# Altium project Main_controller_FOC.PrjPcb
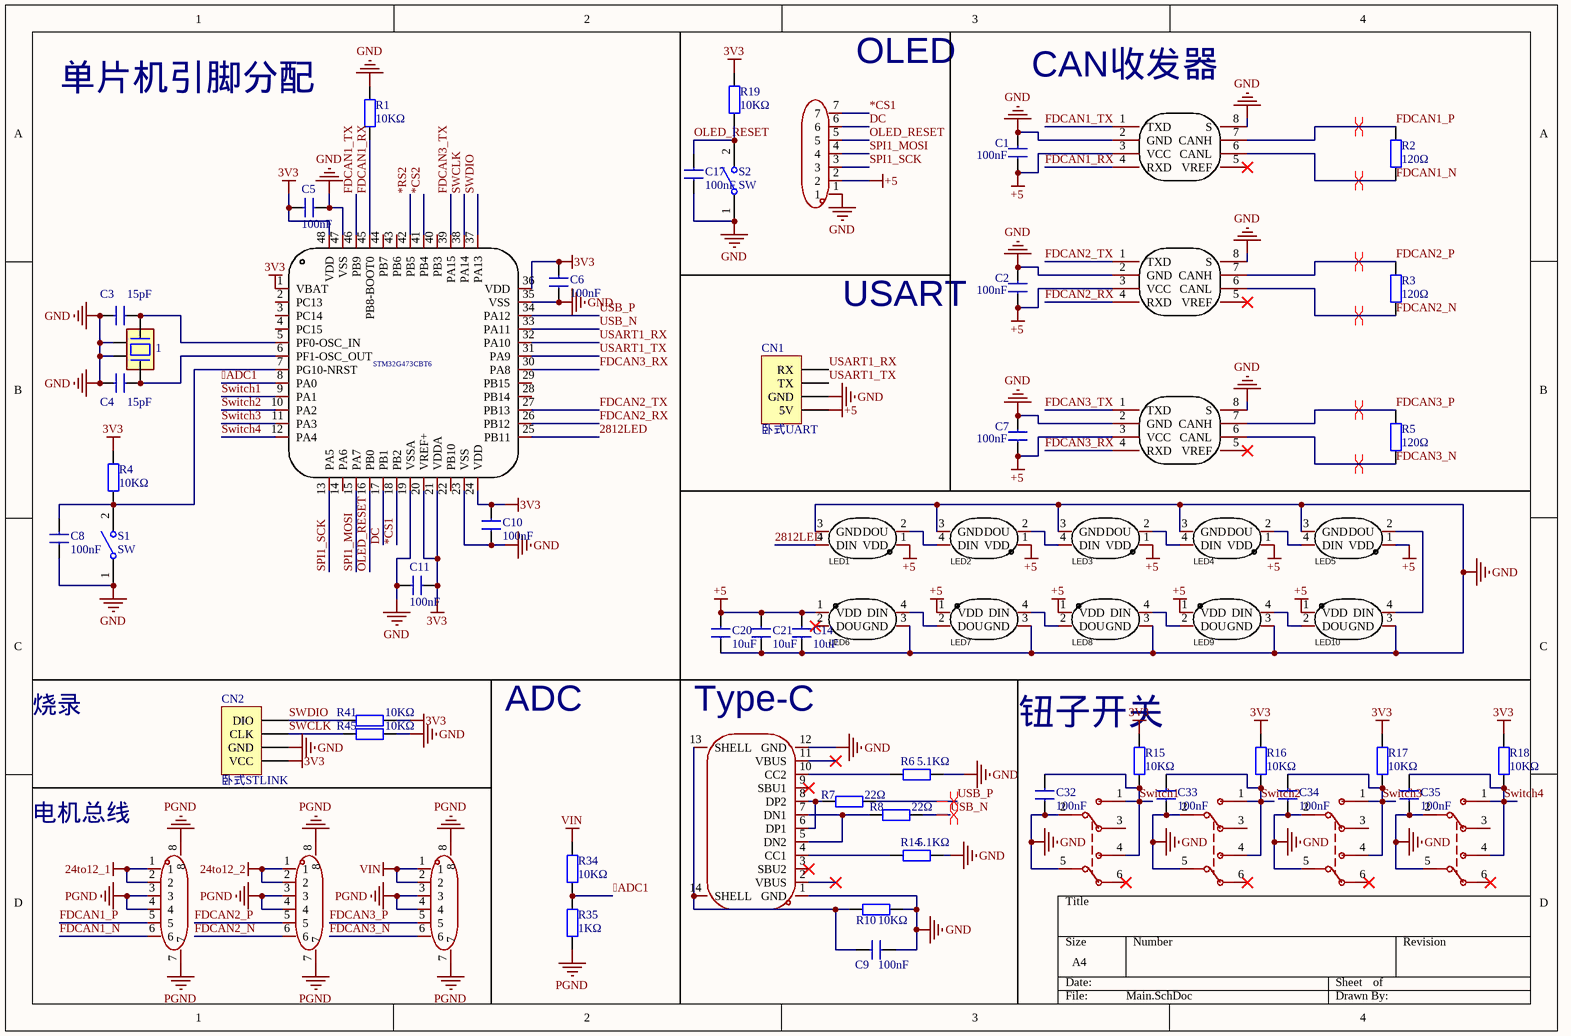
[diagram p0: Main.SchDoc]
2 sheets, 141 parts. Net scope: global (net labels, ports and power ports of the same name join across sheets).
Board file: PCB2.PcbDoc
Sheets:
  Main.SchDoc
  Power.SchDoc

## Sheet Main.SchDoc
size A4; SheetNumber: 1; SheetTotal: 2

### Parts
1  3225贴片晶振  [OSC-3225-4P]  (value not drawn)
C1  100nF  [c0402]
C2  100nF  [c0402]
C3  15pF  [c0402]
C4  15pF  [c0402]
C5  100nF  [c0402]
C6  100nF  [c0402]
C7  100nF  [c0402]
C8  100nF  [c0402]
C9  100nF  [c0402]
C10  100nF  [c0402]
C11  100nF  [c0402]
C14  10uF  [1210]
C17  100nF  [c0402]
C20  10uF  [1210]
C21  10uF  [1210]
C32  100nF  [c0402]
C33  100nF  [c0402]
C34  100nF  [c0402]
C35  100nF  [c0402]
CN1  卧式UART  [CONN-SMD_4P-P1.25_GH1.25-4P]
CN2  卧式STLINK  [CONN-SMD_4P-P1.25_GH1.25-4P]
H1  PM254V-11-07-H85  [HDR-TH_7P-P2.54-V-F]  (value not drawn)
LED1  XL-5050RGBC-WS2812B  [LED-SMD_4P-L5.0-W5.0-BL_XL-5050RGBC]  (value not drawn)
LED2  XL-5050RGBC-WS2812B  [LED-SMD_4P-L5.0-W5.0-BL_XL-5050RGBC]  (value not drawn)
LED3  XL-5050RGBC-WS2812B  [LED-SMD_4P-L5.0-W5.0-BL_XL-5050RGBC]  (value not drawn)
LED4  XL-5050RGBC-WS2812B  [LED-SMD_4P-L5.0-W5.0-BL_XL-5050RGBC]  (value not drawn)
LED5  XL-5050RGBC-WS2812B  [LED-SMD_4P-L5.0-W5.0-BL_XL-5050RGBC]  (value not drawn)
LED6  XL-5050RGBC-WS2812B  [LED-SMD_4P-L5.0-W5.0-BL_XL-5050RGBC]  (value not drawn)
LED7  XL-5050RGBC-WS2812B  [LED-SMD_4P-L5.0-W5.0-BL_XL-5050RGBC]  (value not drawn)
LED8  XL-5050RGBC-WS2812B  [LED-SMD_4P-L5.0-W5.0-BL_XL-5050RGBC]  (value not drawn)
LED9  XL-5050RGBC-WS2812B  [LED-SMD_4P-L5.0-W5.0-BL_XL-5050RGBC]  (value not drawn)
LED10  XL-5050RGBC-WS2812B  [LED-SMD_4P-L5.0-W5.0-BL_XL-5050RGBC]  (value not drawn)
R1  10KΩ  [R0402]
R2  120Ω  [R0402]
R3  120Ω  [R0402]
R4  10KΩ  [R0402]
R5  120Ω  [R0402]
R6  5.1KΩ  [R0402]
R7  22Ω  [R0402]
R8  22Ω  [R0402]
R10  10KΩ  [R0402]
R14  5.1KΩ  [R0402]
R15  10KΩ  [R0402]
R16  10KΩ  [R0402]
R17  10KΩ  [R0402]
R18  10KΩ  [R0402]
R19  10KΩ  [R0402]
R34  10KΩ  [R0402]
R35  1KΩ  [R0402]
R41  10KΩ  [R0402]
R45  10KΩ  [R0402]
S1  SW  [KEY_SMD]
S2  SW  [KEY_SMD]
U1  ZX-ZH1.5-6PWT  [CONN-SMD_6P-P1.50_ZX-ZH1.5-6PWT]  (value not drawn)
U2  SN65HVD1050DR  [SOIC-8_L4.9-W3.9-P1.27-LS6.0-BL]  (value not drawn)
U3  ZX-ZH1.5-6PWT  [CONN-SMD_6P-P1.50_ZX-ZH1.5-6PWT]  (value not drawn)
U4  STM32G474CET6  [LQFP-48]  (value not drawn)
U5  SN65HVD1050DR  [SOIC-8_L4.9-W3.9-P1.27-LS6.0-BL]  (value not drawn)
U6  ZX-ZH1.5-6PWT  [CONN-SMD_6P-P1.50_ZX-ZH1.5-6PWT]  (value not drawn)
U8  SN65HVD1050DR  [SOIC-8_L4.9-W3.9-P1.27-LS6.0-BL]  (value not drawn)
U9  7208P1YZQI  [SW-TH_6P-L12.7-W11.4-P4.70-LS4.8]  (value not drawn)
U10  7208P1YZQI  [SW-TH_6P-L12.7-W11.4-P4.70-LS4.8]  (value not drawn)
U11  7208P1YZQI  [SW-TH_6P-L12.7-W11.4-P4.70-LS4.8]  (value not drawn)
U12  7208P1YZQI  [SW-TH_6P-L12.7-W11.4-P4.70-LS4.8]  (value not drawn)
USB1  TYPE-C 16PIN 2MD(073)  [USB-C-SMD_TYPE-C-6PIN-2MD-073]  (value not drawn)

### Nets
3V3: C5.2 C6.2 C10.2 C11.1 CN2.1(VCC) R4.2 R15.2 R16.2 R17.2 R18.2 R19.2 R41.2 U4.1(VBAT) U4.20(VREF+) U4.21(VDDA) U4.24(VDD) U4.36(VDD) U4.48(VDD)
24to12_1: U1.1 U1.2
24to12_2: U3.1 U3.2
+5: C1.1 C2.1 C7.1 C14.2 C20.2 C21.2 CN1.1(5V) H1.2 LED1.1(VDD) LED2.1(VDD) LED3.1(VDD) LED4.1(VDD) LED5.1(VDD) LED6.1(VDD) LED7.1(VDD) LED8.1(VDD) LED9.1(VDD) LED10.1(VDD) U2.3(VCC) U5.3(VCC) U8.3(VCC)
GND: 1.2 1.4 C1.2 C2.2 C3.1 C4.1 C5.1 C6.1 C7.2 C8.1 C9.2 C10.1 C11.2 C14.1 C17.1 C20.1 C21.1 C32.1 C33.1 C34.1 C35.1 CN1.2(GND) CN2.2(GND) H1.1 LED1.3(GND) LED2.3(GND) LED3.3(GND) LED4.3(GND) LED5.3(GND) LED6.3(GND) LED7.3(GND) LED8.3(GND) LED9.3(GND) LED10.3(GND) R1.1 R6.2 R10.2 R14.2 R45.2 S1.1(COMMON) S2.1(COMMON) U2.2(GND) U2.8(S) U4.19(VSSA) U4.23(VSS) U4.35(VSS) U4.47(VSS) U5.2(GND) U5.8(S) U8.2(GND) U8.8(S) U9.2 U9.5 U10.2 U10.5 U11.2 U11.5 U12.2 U12.5 USB1.1(GND) USB1.12(GND)
PGND: R35.1 U1.3 U1.4 U1.7 U1.8 U3.3 U3.4 U3.7 U3.8 U6.3 U6.4 U6.7 U6.8  [project net A2_1]
VIN: R34.2 U6.1 U6.2
2812LED: LED1.4(DIN) U4.25(PB11)
ADC1: R34.1 R35.2 U4.8(PA0)
*CS1: H1.7 U4.18(PB2)
*CS2: U4.41(PB4)
*RS2: U4.42(PB5)
DC: H1.6 U4.17(PB1)
FDCAN1_N: R2.1 U1.6 U2.6(CANL)
FDCAN1_P: R2.2 U1.5 U2.7(CANH)
FDCAN1_RX: R1.2 U2.4(RXD) U4.45(PB8-BOOT0)
FDCAN1_TX: U2.1(TXD) U4.46(PB9)
FDCAN2_N: R3.1 U3.6 U5.6(CANL)
FDCAN2_P: R3.2 U3.5 U5.7(CANH)
FDCAN2_RX: U4.26(PB12) U5.4(RXD)
FDCAN2_TX: U4.27(PB13) U5.1(TXD)
FDCAN3_N: R5.1 U6.6 U8.6(CANL)
FDCAN3_P: R5.2 U6.5 U8.7(CANH)
FDCAN3_RX: U4.30(PA8) U8.4(RXD)
FDCAN3_TX: U4.39(PA15) U8.1(TXD)
OLED_RESET: C17.2 H1.5 R19.1 S2.2(NO) U4.16(PB0)
SPI1_MOSI: H1.4 U4.15(PA7)
SPI1_SCK: H1.3 U4.13(PA5)
SWCLK: CN2.3(CLK) R45.1 U4.38(PA14)
SWDIO: CN2.4(DIO) R41.1 U4.37(PA13)
Switch1: C32.2 R15.1 U4.9(PA1) U9.1 U9.4
Switch2: C33.2 R16.1 U4.10(PA2) U10.1 U10.4
Switch3: C34.2 R17.1 U4.11(PA3) U11.1 U11.4
Switch4: C35.2 R18.1 U4.12(PA4) U12.1 U12.4
USART1_RX: CN1.4(RX) U4.32(PA10)
USART1_TX: CN1.3(TX) U4.31(PA9)
USB_N: R8.2 U4.33(PA11)
USB_P: R7.2 U4.34(PA12)
Net1_1: 1.1 C4.2 U4.6(PF1-OSC_OUT)
Net1_3: 1.3 C3.2 U4.5(PF0-OSC_IN)
NetC8_2: C8.2 R4.1 S1.2(NO) U4.7(PG10-NRST)
NetC9_1: C9.1 R10.1 USB1.13(SHELL) USB1.14(SHELL)
NetLED1_2: LED1.2(DOU) LED2.4(DIN)
NetLED2_2: LED2.2(DOU) LED3.4(DIN)
NetLED3_2: LED3.2(DOU) LED4.4(DIN)
NetLED4_2: LED4.2(DOU) LED5.4(DIN)
NetLED5_2: LED5.2(DOU) LED10.4(DIN)
NetLED6_4: LED6.4(DIN) LED7.2(DOU)
NetLED7_4: LED7.4(DIN) LED8.2(DOU)
NetLED8_4: LED8.4(DIN) LED9.2(DOU)
NetLED9_4: LED9.4(DIN) LED10.2(DOU)
NetR6_1: R6.1 USB1.10(CC2)
NetR7_1: R7.1 USB1.6(DP1) USB1.8(DP2)
NetR8_1: R8.1 USB1.5(DN2) USB1.7(DN1)
NetR14_1: R14.1 USB1.4(CC1)

Not connected (* = marked no-connect by the designer): LED6 2(DOU)*; U2 5(VREF)*; U4 2(PC13) 3(PC14) 4(PC15) 14(PA6) 22(PB10) 28(PB14) 29(PB15) 40(PB3) 43(PB6) 44(PB7); U5 5(VREF)*; U8 5(VREF)*; U9 3 6*; U10 3 6*; U11 3 6*; U12 3 6*; USB1 2(VBUS)* 3(SBU2)* 9(SBU1)* 11(VBUS)*

### Layout directives
differential pair: FDCAN1_N, FDCAN1_P, FDCAN2_N, FDCAN2_P, FDCAN3_N, FDCAN3_P, USB_N, USB_P

### Notes on the sheet
- 单片机引脚分配
- (near H1) OLED
- CAN收发器
- USART
- 烧录
- ADC
- Type-C
- 钮子开关
- 电机总线

### Library data of the parts
1 = 3225贴片晶振: Value: 16M
C1-C11 C17 C32-C35 = 0402贴片电容: 贴片电容0402
C14 C20 C21 = 1210贴片电容
H1 = PM254V-11-07-H85: Manufacturer: XFCN(兴飞); Add into BOM: yes; Holes Structure: 1x7P; Pitch: 2.54mm; Circular Hole / Square Hole: 方孔; Number of Holes: 7P; Current Rating (Max): 3A; Voltage Rating (Max): 250V; Holes Direction: 顶部; Symbol: PM254V-11-07-H85; Device: PM254V-11-07-H85; LCSC Part Name: 间距:2.54mm 1x7P 直插; Supplier Part: C2832270; Manufacturer Part: PM254V-11-07-H85; Supplier Footprint: 插件,P=2.54mm; JLCPCB Part Class: Extended Part; Datasheet: https://atta.szlcsc.com/upload/public/pdf/source/20210514/C2832270_F424CC0071A81298BFB56B53406F9842.pdf; Supplier: LCSC; Convert to PCB: yes; Row Spacing: -; Mounting Type: 直插; Number of Rows: 单排; Insulation Height: -; Operating Temperature Range: -40℃~+105℃
LED1-LED10 = WS2812B彩灯珠: Manufacturer: XINGLIGHT(成兴光); Add into BOM: yes; Emitted Color: RGB三色; Peak Wavelength: 625nm；470nm；530nm; Lens Color: 无色透明透镜; Viewing Angle: 120°; Mounting Sytle: 正贴; Symbol: XL-5050RGBC-WS2812B; Device: XL-5050RGBC-WS2812B; LCSC Part Name: XL-5050RGBC-WS2812B; Supplier Part: C2843785; Manufacturer Part: XL-5050RGBC-WS2812B; Supplier Footprint: SMD5050; JLCPCB Part Class: Extended Part; Datasheet: https://atta.szlcsc.com/upload/public/pdf/source/20230111/86AAD2096485A2E5BCAB883FF8CBE6FD.pdf; Supplier: LCSC; Convert to PCB: yes; Power Dissipation: -; Forward Current: -; Dominant Wavelength: -; Diode Configuration: -; Color Temperature: -; Operating Temperature: -20℃~+85℃
R1-R8 R10 R14-R19 R34 R35 R41 R45 = 0402贴片电阻: W: *
S1 S2 = SW: 开关
U1 U3 U6 = ZX-ZH1.5-6PWT: Manufacturer: Megastar(兆星); Add into BOM: yes; Pins Structure: 1x6P; Pitch: 1.5mm; Reference Series: ZH; Number of PINs Per Row: 6; Rated Current: 1A; Rated Voltage (Max): 250V; Plastic Material: LCP; Supplementary Features: 辅助焊脚; Z-Height of the Board: 3.8mm; X-Length of Bottom Edge on Board (Spacing Line): 12mm; Y-Width of Bottom Edge on Board: 6.5mm; Symbol: ZX-ZH1.5-6PWT; Device: ZX-ZH1.5-6PWT; LCSC Part Name: 1x6P 间距:1.5mm 卧贴 系列:ZH; Supplier Part: C19272409; Manufacturer Part: ZX-ZH1.5-6PWT; Supplier Footprint: SMD,P=1.5mm,卧贴; JLCPCB Part Class: Extended Part; Datasheet: https://atta.szlcsc.com/upload/public/pdf/source/20231201/C5A824B953C40A6060EBF5A541254C86.pdf; Supplier: LCSC; Convert to PCB: yes; Mounting Type: 卧贴; Number of Pins: 6P; Number of Rows: 1; Row Spacing: -; Contact Material: 黄铜; Contact Plating: 锡; Operating Temperature: -25℃~+85℃; Flame Retardant Rating: -; Color: 米色
U2 U5 U8 = SN65HVD1050DR: CAN芯片; Manufacturer: TI(德州仪器); Add into BOM: yes; Supply Voltage: 4.5V~5.5V; Supply Current: 50mA; Name: SN65HVD1050DR; Symbol: SN65HVD1050DR; Device: SN65HVD1050DR; LCSC Part Name: 4.5V~5.5V; Supplier Part: C14019; Manufacturer Part: SN65HVD1050DR; Supplier Footprint: SOIC-8; JLCPCB Part Class: Extended Part; Datasheet: https://www.ti.com/cn/lit/gpn/sn65hvd1050; Supplier: LCSC; Convert to PCB: yes; Type: 收发器; Operating Temperature: -40℃~+125℃
U4 = STM32G474CET6: Manufacturer: ST(意法半导体); Symbol: STM32G473CBT6; Add into BOM: yes; Device: STM32G473CBT6; Supplier: LCSC; Supplier Part: C730111; Manufacturer Part: STM32G473CBT6; JLCPCB Part Class: Extended Part; LCSC Part Name: STM32G473CBT6; Supplier Footprint: LQFP-48(7x7); Datasheet: https://atta.szlcsc.com/upload/public/pdf/source/20200902/C730111_19331807E2800E1C1C13BFFAAC550E20.pdf; Convert to PCB: yes
U9-U12 = 7208P1YZQI: Manufacturer: C&K; Add into BOM: yes; Circuit: 双刀双掷; Voltage Rating (AC): 120V; Voltage Rating (DC): 28V; Actuator Type: 圆柱钮柄; Pin Style: 焊片; Symbol: 7208P1YZQI; Device: 7208P1YZQI; LCSC Part Name: 7208P1YZQI 五件套; Supplier Part: C2824481; Manufacturer Part: 7208P1YZQI; Supplier Footprint: 插件; JLCPCB Part Class: Extended Part; Datasheet: https://atta.szlcsc.com/upload/public/pdf/source/20211221/AC201C7675510E1A13CA92FD8B8259B6.pdf; Supplier: LCSC; Convert to PCB: yes; Mounting Style: 直插; Operating Temperature: -30℃~+85℃
USB1 = TYPE-C 16PIN 2MD(073): Manufacturer: SHOU HAN(首韩); Add into BOM: yes; Gender: 母; Number of Contacts: 16P; Number of Ports: 1; Current Rating - Power (Max): 5A; Rated Voltage (Max): 5V; Connect-Disconnect Life: 5千次; Core Colour: 黑色; Symbol: TYPE-C 16PIN 2MD(073); Device: TYPE-C 16PIN 2MD(073); LCSC Part Name: Type-C 母 卧贴; Supplier Part: C2765186; Manufacturer Part: TYPE-C 16PIN 2MD(073); Supplier Footprint: SMD; JLCPCB Part Class: Extended Part; Datasheet: https://atta.szlcsc.com/upload/public/pdf/source/20211123/39B17C16241EAC15C5E277BDA434118E.pdf; Supplier: LCSC; Convert to PCB: yes; Connector Type: Type-C; Standard: USB 3.1; Mounting Style: 卧贴; Operating Temperature Range: -25℃~+85℃

## Sheet Power.SchDoc
size A3; SheetNumber: 2; SheetTotal: 2
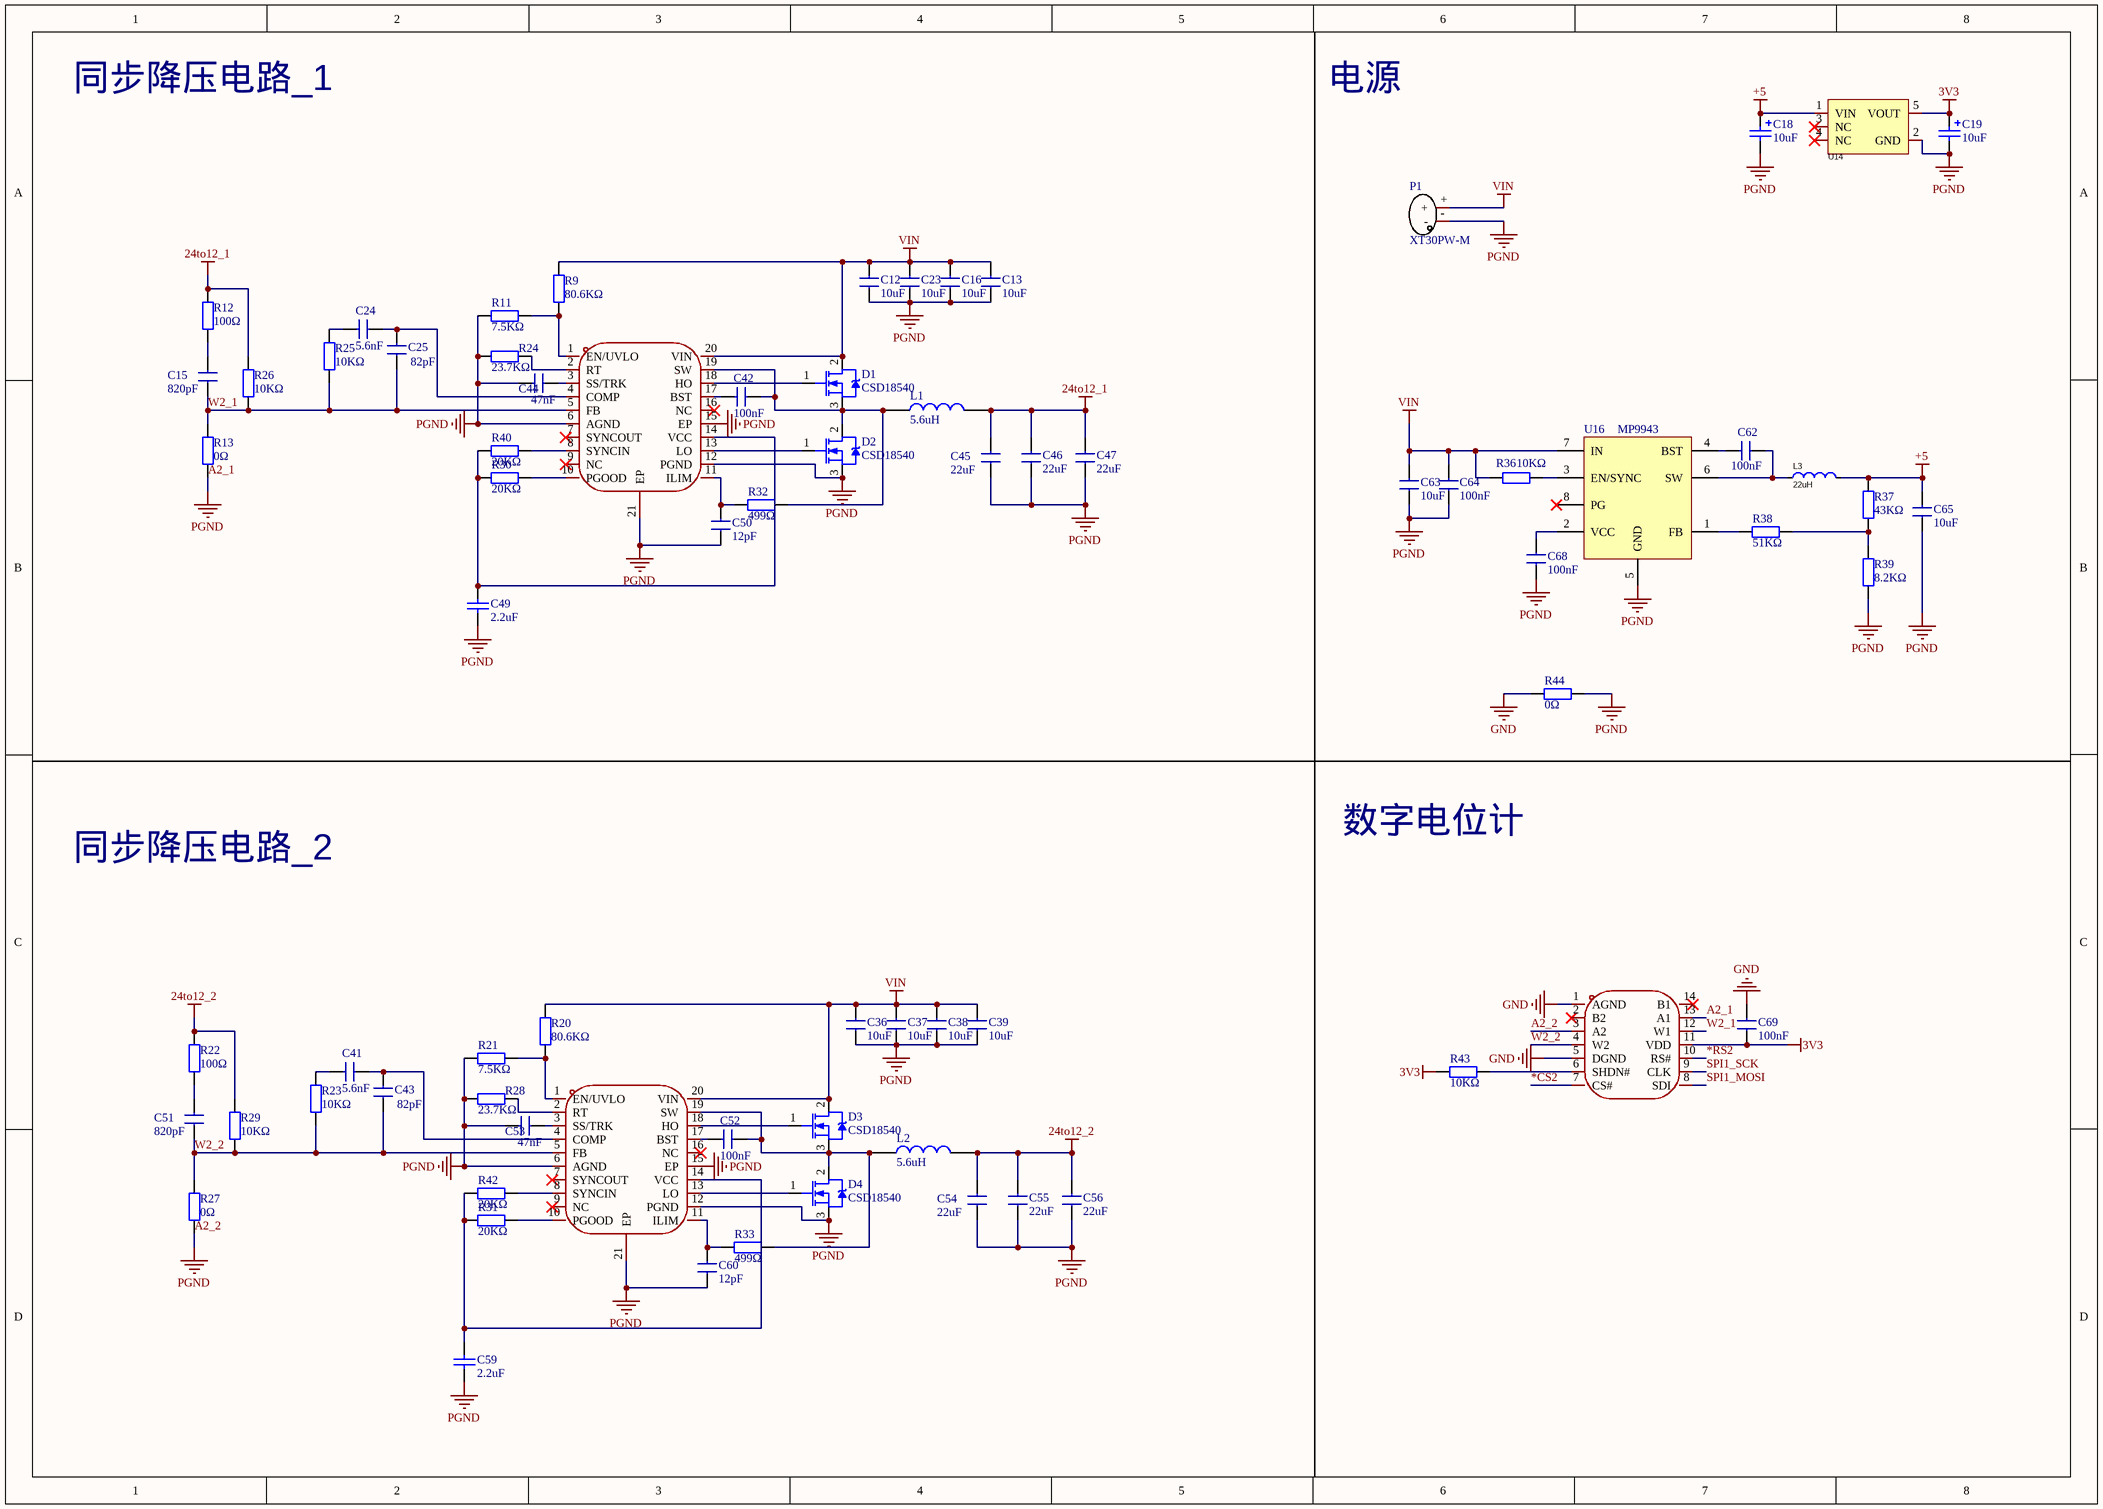
[diagram p1: Power.SchDoc]

### Parts
C12  10uF  [1210]
C13  10uF  [1210]
C15  820pF  [c0402]
C16  10uF  [1210]
C18  10uF  [3216]
C19  10uF  [3216]
C23  10uF  [1210]
C24  5.6nF  [c0402]
C25  82pF  [c0402]
C36  10uF  [1210]
C37  10uF  [1210]
C38  10uF  [1210]
C39  10uF  [1210]
C41  5.6nF  [c0402]
C42  100nF  [C 0603_M]
C43  82pF  [c0402]
C44  47nF  [c0402]
C45  22uF  [1210]
C46  22uF  [1210]
C47  22uF  [1210]
C49  2.2uF  [C 0603_M]
C50  12pF  [c0402]
C51  820pF  [c0402]
C52  100nF  [C 0603_M]
C53  47nF  [c0402]
C54  22uF  [1210]
C55  22uF  [1210]
C56  22uF  [1210]
C59  2.2uF  [C 0603_M]
C60  12pF  [c0402]
C62  100nF  [c0402]
C63  10uF  [1210]
C64  100nF  [c0402]
C65  10uF  [1210]
C68  100nF  [c0402]
C69  100nF  [c0402]
D1  CSD18540  [pg-tdson-8]
D2  CSD18540  [pg-tdson-8]
D3  CSD18540  [pg-tdson-8]
D4  CSD18540  [pg-tdson-8]
L1  5.6uH  [L-SMD-0630]
L2  5.6uH  [L-SMD-0630]
L3  22uH  [IND-SMD_L5.4-W5.2]
P1  XT30PW-M  [XT30PW-M]
R9  80.6KΩ  [R0402]
R11  7.5KΩ  [R0402]
R12  100Ω  [R0402]
R13  0Ω  [R0402]
R20  80.6KΩ  [R0402]
R21  7.5KΩ  [R0402]
R22  100Ω  [R0402]
R23  10KΩ  [R0402]
R24  23.7KΩ  [R0402]
R25  10KΩ  [R0402]
R26  10KΩ  [R0402]
R27  0Ω  [R0402]
R28  23.7KΩ  [R0402]
R29  10KΩ  [R0402]
R30  20KΩ  [R0402]
R31  20KΩ  [R0402]
R32  499Ω  [R0402]
R33  499Ω  [R0402]
R36  10KΩ  [R0402]
R37  43KΩ  [R0402]
R38  51KΩ  [R0402]
R39  8.2KΩ  [R0402]
R40  20KΩ  [R0402]
R42  20KΩ  [R0402]
R43  10KΩ  [R0402]
R44  0Ω  [R0402]
U7  LM25145RGYR  [VQFN-20_L4.5-W3.5-P0.50-BL-EP]  (value not drawn)
U13  LM25145RGYR  [VQFN-20_L4.5-W3.5-P0.50-BL-EP]  (value not drawn)
U14  XC6201P332MR-HXY  [SOT-23-5_L3.0-W1.7-P0.95-LS2.8-BR]  (value not drawn)
U16  MP9943  [QFN-8 3x3]
U17  AD8402ARZ10-REEL  [SOIC-14_L8.7-W3.9-P1.27-LS6.0-BL]  (value not drawn)

### Nets
3V3: C19.1 C69.2 R43.2 U14.5(VOUT) U17.11(VDD)
24to12_1: C45.2 C46.2 C47.2 L1.2 R12.2 R26.2
24to12_2: C54.2 C55.2 C56.2 L2.2 R22.2 R29.2
+5: C18.1 C65.2 L3.2 R37.2 U14.1(VIN)
A2_1: C12.1 C13.1 C16.1 C18.2 C19.2 C23.1 C36.1 C37.1 C38.1 C39.1 C44.2 C45.1 C46.1 C47.1 C49.1 C50.1 C53.2 C54.1 C55.1 C56.1 C59.1 C60.1 C63.1 C64.1 C65.1 C68.1 D2.3(S) D4.3(S) P1.- R11.1 R13.2 R21.1 R24.2 R27.2 R28.2 R39.1 R44.2 U7.6(AGND) U7.12(PGND) U7.15(EP) U7.21(EP) U13.6(AGND) U13.12(PGND) U13.15(EP) U13.21(EP) U14.2(GND) U16.5(GND) U17.3(A2) U17.13(A1)  [also labelled A2_2, PGND]
GND: C69.1 R44.1 U17.1(AGND) U17.5(DGND)
VIN: C12.2 C13.2 C16.2 C23.2 C36.2 C37.2 C38.2 C39.2 C63.2 C64.2 D1.2(D) D3.2(D) P1.+ R9.1 R20.1 R36.1 U7.20(VIN) U13.20(VIN) U16.7(IN)
*CS2: U17.7(CS#)
*RS2: U17.10(RS#)
SPI1_MOSI: U17.8(SDI)
SPI1_SCK: U17.9(CLK)
W2_1: C15.2 C25.1 R13.1 R25.1 R26.1 U13.5(FB) U17.12(W1)
W2_2: C43.1 C51.2 R23.1 R27.1 R29.1 U7.5(FB) U17.4(W2)
NetC15_1: C15.1 R12.1
NetC24_1: C24.1 C25.2 U13.4(COMP)
NetC24_2: C24.2 R25.2
NetC41_1: C41.1 C43.2 U7.4(COMP)
NetC41_2: C41.2 R23.2
NetC42_1: C42.1 D1.3(S) D2.2(D) L1.1 R32.1 U13.19(SW)
NetC42_2: C42.2 U13.17(BST)
NetC44_1: C44.1 U13.3(SS/TRK)
NetC49_2: C49.2 R30.2 R40.2 U13.14(VCC)
NetC50_2: C50.2 R32.2 U13.11(ILIM)
NetC51_1: C51.1 R22.1
NetC52_1: C52.1 D3.3(S) D4.2(D) L2.1 R33.1 U7.19(SW)
NetC52_2: C52.2 U7.17(BST)
NetC53_1: C53.1 U7.3(SS/TRK)
NetC59_2: C59.2 R31.2 R42.2 U7.14(VCC)
NetC60_2: C60.2 R33.2 U7.11(ILIM)
NetC62_1: C62.1 U16.4(BST)
NetC62_2: C62.2 L3.1 U16.6(SW)
NetC68_2: C68.2 U16.2(VCC)
NetD1_1: D1.1(G) U13.18(HO)
NetD2_1: D2.1(G) U13.13(LO)
NetD3_1: D3.1(G) U7.18(HO)
NetD4_1: D4.1(G) U7.13(LO)
NetR9_2: R9.2 R11.2 U13.1(EN/UVLO)
NetR20_2: R20.2 R21.2 U7.1(EN/UVLO)
NetR24_1: R24.1 U13.2(RT)
NetR28_1: R28.1 U7.2(RT)
NetR30_1: R30.1 U13.10(PGOOD)
NetR31_1: R31.1 U7.10(PGOOD)
NetR36_2: R36.2 U16.3(EN/SYNC)
NetR37_1: R37.1 R38.2 R39.2
NetR38_1: R38.1 U16.1(FB)
NetR40_1: R40.1 U13.8(SYNCIN)
NetR42_1: R42.1 U7.8(SYNCIN)
NetR43_1: R43.1 U17.6(SHDN#)

Not connected (* = marked no-connect by the designer): U7 7(SYNCOUT)* 9(NC)* 16(NC)*; U13 7(SYNCOUT)* 9(NC)* 16(NC)*; U14 3(NC)* 4(NC)*; U16 8(PG)*; U17 2(B2)* 14(B1)*

### Notes on the sheet
- 同步降压电路_1
- 电源
- 数字电位计
- 同步降压电路_2

### Library data of the parts
C12 C13 C16 C23 C36-C39 C45-C47 C54-C56 C63 C65 = 1210贴片电容
C15 C24 C25 C41-C44 C50-C53 C60 C62 C64 C68 C69 = 0402贴片电容: 贴片电容0402
C18 C19 = 3216钽电容
C49 C59 = 0603贴片电容
D1-D4 = CSD18540: N沟道MOS管; Note: Pin 2 is electrically connected to pin 4.; Published: 8-Jun-2000; LatestRevisionDate: 17-Jul-2002; LatestRevisionNote: Re-released for DXP Platform.; DatasheetVersion: PD-9.814; PackageVersion: Feb-1997; PackageReference: TO-220AB; Publisher: Altium Limited; PackageDescription: TO, Thru-Hole, Vertical, Heatsink Mounted; 3 In-Line Leads; Pitch 2.54 mm; ComponentLink1Description: Manufacturer Link; ComponentLink1URL: http://www.irf.com/
L1 L2 = 0630功率电感: 一体成型屏蔽电感
L3 = 0530屏蔽电感: 一体成型屏蔽电感，0530封装，额定电流3A; Manufacturer: XR(祥如); Symbol: XR0530-100M; Add into BOM: yes; Value: 10uH; Tolerance: ±20%; Rated Current: 3.2A; Saturation Current (Isat): 3.5A; DC Resistance (DCR): 125mΩ; Type: 一体成型电感; Device: XR0530-100M; LCSC Part Name: 10uH ±20% 3.5A; Supplier Part: C5307602; Manufacturer Part: XR0530-100M; Supplier Footprint: SMD,0530; JLCPCB Part Class: Extended Part; Datasheet: https://atta.szlcsc.com/upload/public/pdf/source/20240328/42FE63A3232C4AF7EB8F1CDEDD5FC69F.pdf; Supplier: LCSC; Convert to PCB: yes
P1 = 卧式XT30母头: LatestRevisionDate: 17-Jul-2002; LatestRevisionNote: Re-released for DXP Platform.; Publisher: Altium Limited
R9 R11-R13 R20-R33 R36-R40 R42-R44 = 0402贴片电阻: W: *
U7 U13 = LM25145RGYR: Manufacturer: TI(德州仪器); Add into BOM: yes; Function: 降压型; Output Type: 可调; Input Voltage: 6V~42V; Output Voltage: 800mV~40V; Output Current: 20A; Switching Frequency: 100kHz~1MHz; Synchronous Rectification: 是; Number of Outputs: 1; Topology: 降压式; Switch tube (built-in/external): 外置; Symbol: LM25145RGYR; Device: LM25145RGYR; LCSC Part Name: LM251456V至42V同步降压直流/直流控制器; Supplier Part: C2876740; Manufacturer Part: LM25145RGYR; Supplier Footprint: VQFN-20-EP(3.5x4.5); JLCPCB Part Class: Extended Part; Datasheet: https://www.ti.com/cn/lit/gpn/lm25145; Supplier: LCSC; Convert to PCB: yes; Operating Temperature: -40℃~+125℃; Quiescent Current (Iq): -
U14 = XC6201P332MR-HXY: 3.3V LDO; Manufacturer: HXY MOSFET(华轩阳电子); Add into BOM: yes; Output Type: 固定; Maximum Input Voltage: 12V; MAX Output Current: 300mA; Output Polarity: 正极; Symbol: XC6201P332MR-HXY; Device: XC6201P332MR-HXY; LCSC Part Name: XC6201P332MR-HXY; Supplier Part: C19626990; Manufacturer Part: XC6201P332MR-HXY; Supplier Footprint: SOT-23-5L; JLCPCB Part Class: Extended Part; Datasheet: https://atta.szlcsc.com/upload/public/pdf/source/20231208/3D7EFECB06481ED5AED4680614D7FFF5.pdf; Supplier: LCSC; Convert to PCB: yes; Output Voltage: 3.3V
U17 = AD8402ARZ10-REEL: Manufacturer: ADI(亚德诺); Add into BOM: yes; Resistance Value (Ohms): 10kΩ; Number of Taps: 256; Number of Channels: 2; Precision: ±20%; Supply Voltage: 2.7V~5.5V; Interface Type: SPI; Temperature Coefficient (Typ): 500ppm/℃; Symbol: AD8402ARZ10-REEL; Device: AD8402ARZ10-REEL; LCSC Part Name: 1-/2-/4-通道数字电位器; Supplier Part: C578716; Manufacturer Part: AD8402ARZ10-REEL; Supplier Footprint: SOIC-14; JLCPCB Part Class: Extended Part; Datasheet: https://atta.szlcsc.com/upload/public/pdf/source/20211026/F04B6EDA79C62679C80111A8307D6AD8.pdf; Supplier: LCSC; Convert to PCB: yes; Operating Temperature: -40℃~+125℃

## Nets that join several sheets
3V3: Main (18 pins), Power (5 pins)
24to12_1: Main (U1.1 U1.2), Power (6 pins)
24to12_2: Main (U3.1 U3.2), Power (6 pins)
+5: Main (21 pins), Power (5 pins)
A2_1: Main (13 pins), Power (49 pins)
GND: Main (61 pins), Power (C69.1 R44.1 U17.1 U17.5)
VIN: Main (R34.2 U6.1 U6.2), Power (19 pins)
*CS2: Main (U4.41), Power (U17.7)
*RS2: Main (U4.42), Power (U17.10)
SPI1_MOSI: Main (H1.4 U4.15), Power (U17.8)
SPI1_SCK: Main (H1.3 U4.13), Power (U17.9)